# EAGLE design OutputModule (EAGLE 7.6.0)
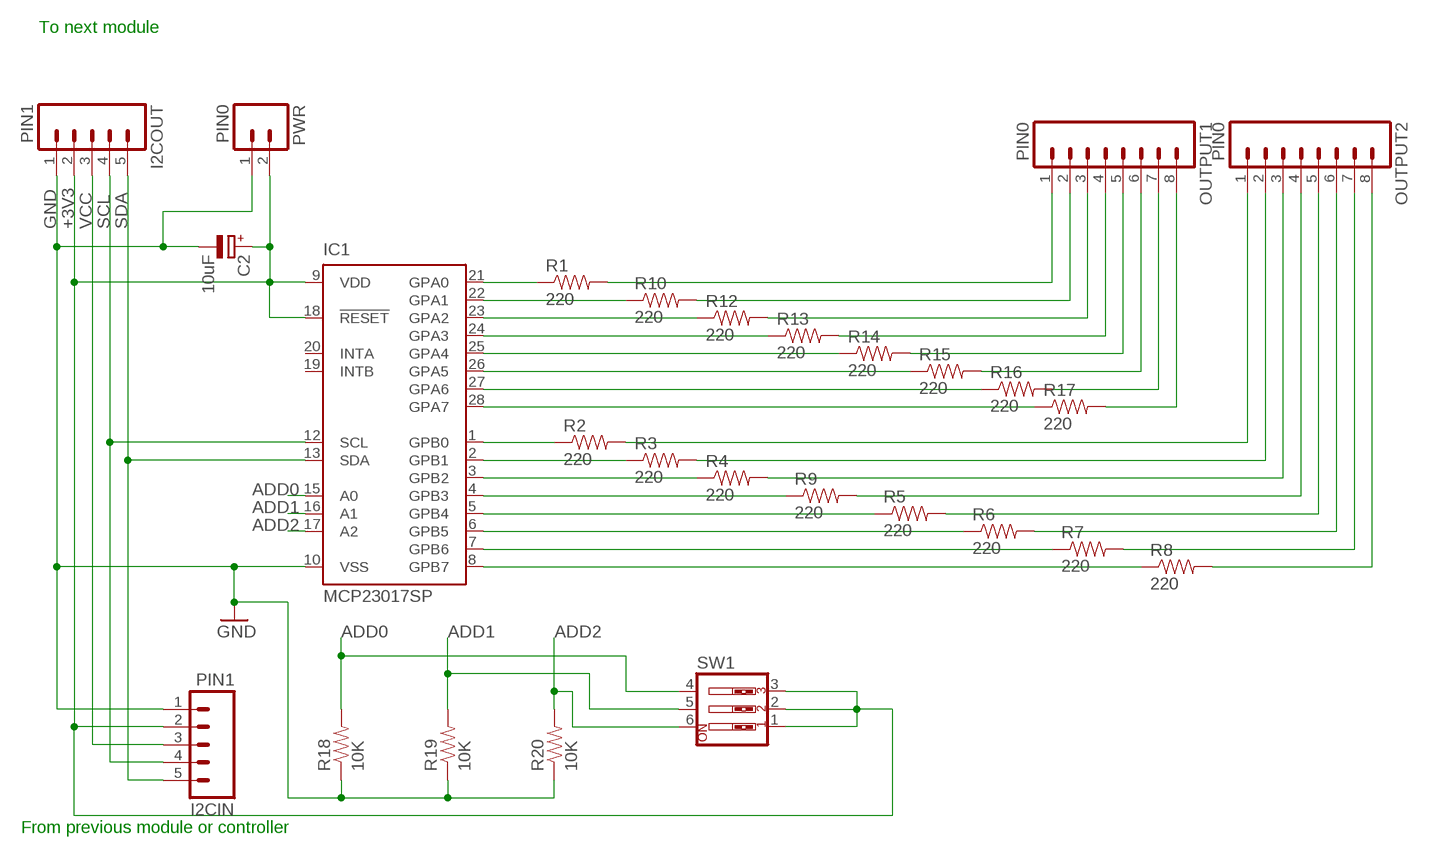
[diagram p0: schematic, sheet 1]

## Parts
C2  10uF  CPOL-EUE2.5-6  [E2,5-6]
I2CIN  PIN1  M05  [05P]
I2COUT  PIN1  M05  [05P]
IC1  MCP23017SP  [DIL28-3]
OUTPUT1  PIN0  M08  [1X08_ROUND]
OUTPUT2  PIN0  M08  [1X08_ROUND]
PWR  PIN0  M02  [02P]
R1  220  RESISTORPTH-1/4W  [AXIAL-0.4]
R2  220  RESISTORPTH-1/4W  [AXIAL-0.4]
R3  220  RESISTORPTH-1/4W  [AXIAL-0.4]
R4  220  RESISTORPTH-1/4W  [AXIAL-0.4]
R5  220  RESISTORPTH-1/4W  [AXIAL-0.4]
R6  220  RESISTORPTH-1/4W  [AXIAL-0.4]
R7  220  RESISTORPTH-1/4W  [AXIAL-0.4]
R8  220  RESISTORPTH-1/4W  [AXIAL-0.4]
R9  220  RESISTORPTH-1/4W  [AXIAL-0.4]
R10  220  RESISTORPTH-1/4W  [AXIAL-0.4]
R12  220  RESISTORPTH-1/4W  [AXIAL-0.4]
R13  220  RESISTORPTH-1/4W  [AXIAL-0.4]
R14  220  RESISTORPTH-1/4W  [AXIAL-0.4]
R15  220  RESISTORPTH-1/4W  [AXIAL-0.4]
R16  220  RESISTORPTH-1/4W  [AXIAL-0.4]
R17  220  RESISTORPTH-1/4W  [AXIAL-0.4]
R18  10K  RESISTORPTH-1/4W  [AXIAL-0.4]
R19  10K  RESISTORPTH-1/4W  [AXIAL-0.4]
R20  10K  RESISTORPTH-1/4W  [AXIAL-0.4]
SW1  SW_DIP-3  [EDG-03]

## Nets
+3V3: C2.+ I2CIN.2 I2COUT.2 IC1.9(VDD) IC1.18(!RESET) PWR.2 SW1.1 SW1.2 SW1.3
ADD0: IC1.15(A0) R18.P$2 SW1.4
ADD1: IC1.16(A1) R19.P$2 SW1.5
ADD2: IC1.17(A2) R20.P$2 SW1.6
GND: C2.- I2CIN.1 I2COUT.1 IC1.10(VSS) PWR.1 R18.P$1 R19.P$1 R20.P$1
N$1: OUTPUT2.7 R7.P$2
N$2: OUTPUT2.1 R2.P$2
N$3: OUTPUT2.2 R3.P$2
N$4: OUTPUT2.3 R4.P$2
N$5: OUTPUT2.4 R9.P$2
N$6: OUTPUT2.5 R5.P$2
N$7: OUTPUT1.8 R17.P$2
N$8: OUTPUT1.7 R16.P$2
N$9: IC1.1(GPB0) R2.P$1
N$10: IC1.2(GPB1) R3.P$1
N$11: IC1.3(GPB2) R4.P$1
N$12: IC1.5(GPB4) R5.P$1
N$13: IC1.6(GPB5) R6.P$1
N$14: IC1.7(GPB6) R7.P$1
N$15: IC1.8(GPB7) R8.P$1
N$16: OUTPUT2.6 R6.P$2
N$17: IC1.4(GPB3) R9.P$1
N$18: OUTPUT2.8 R8.P$2
N$19: IC1.21(GPA0) R1.P$1
N$20: IC1.22(GPA1) R10.P$1
N$21: IC1.23(GPA2) R12.P$1
N$22: IC1.24(GPA3) R13.P$1
N$23: IC1.25(GPA4) R14.P$1
N$24: IC1.26(GPA5) R15.P$1
N$25: IC1.27(GPA6) R16.P$1
N$26: IC1.28(GPA7) R17.P$1
N$27: OUTPUT1.6 R15.P$2
N$28: OUTPUT1.5 R14.P$2
N$29: OUTPUT1.4 R13.P$2
N$30: OUTPUT1.3 R12.P$2
N$31: OUTPUT1.2 R10.P$2
N$32: OUTPUT1.1 R1.P$2
SCL: I2CIN.4 I2COUT.4 IC1.12(SCL)
SDA: I2CIN.5 I2COUT.5 IC1.13(SDA)
VCC: I2CIN.3 I2COUT.3
Unconnected: IC1.19(INTB) IC1.20(INTA)

## Notes on the sheet
- To next module
- From previous module or controller

## Library data of the parts
C2 = rcl:CPOL-EU: POLARIZED CAPACITOR, European symbol
I2CIN I2COUT = con-amp-quick:M05: AMP QUICK CONNECTOR; OC_FARNELL: unknown; OC_NEWARK: unknown
IC1 = microchip:MCP23017: http://ww1.microchip.com/downloads/en/DeviceDoc/21952a.pdf Source: http://ww1.microchip.com/downloads/en/DeviceDoc/21952a.pdf; MF: MICROCHIP; MPN: MCP23017-E/SP; OC_FARNELL: 1332088; OC_NEWARK: 31K2959
OUTPUT1 OUTPUT2 = SparkFun-Connectors:M08: Header 8 Standard 8-pin 0.1" header. Use with straight break away headers (SKU : PRT-00116), right angle break away headers (PRT-00553), swiss pins (PRT-00743), machine pins (PRT-00117), and female headers (PRT-00115).; PROD_ID: CONN-08437
PWR = con-amp-quick:M02: AMP QUICK CONNECTOR; OC_FARNELL: unknown; OC_NEWARK: unknown
R1-R10 R12-R20 = SparkFun-Passives:RESISTOR: Resistor Basic schematic elements and footprints for 0603, 1206, and PTH resistors.
SW1 = special:SW_DIP-3: DIP SWITCH

## Board
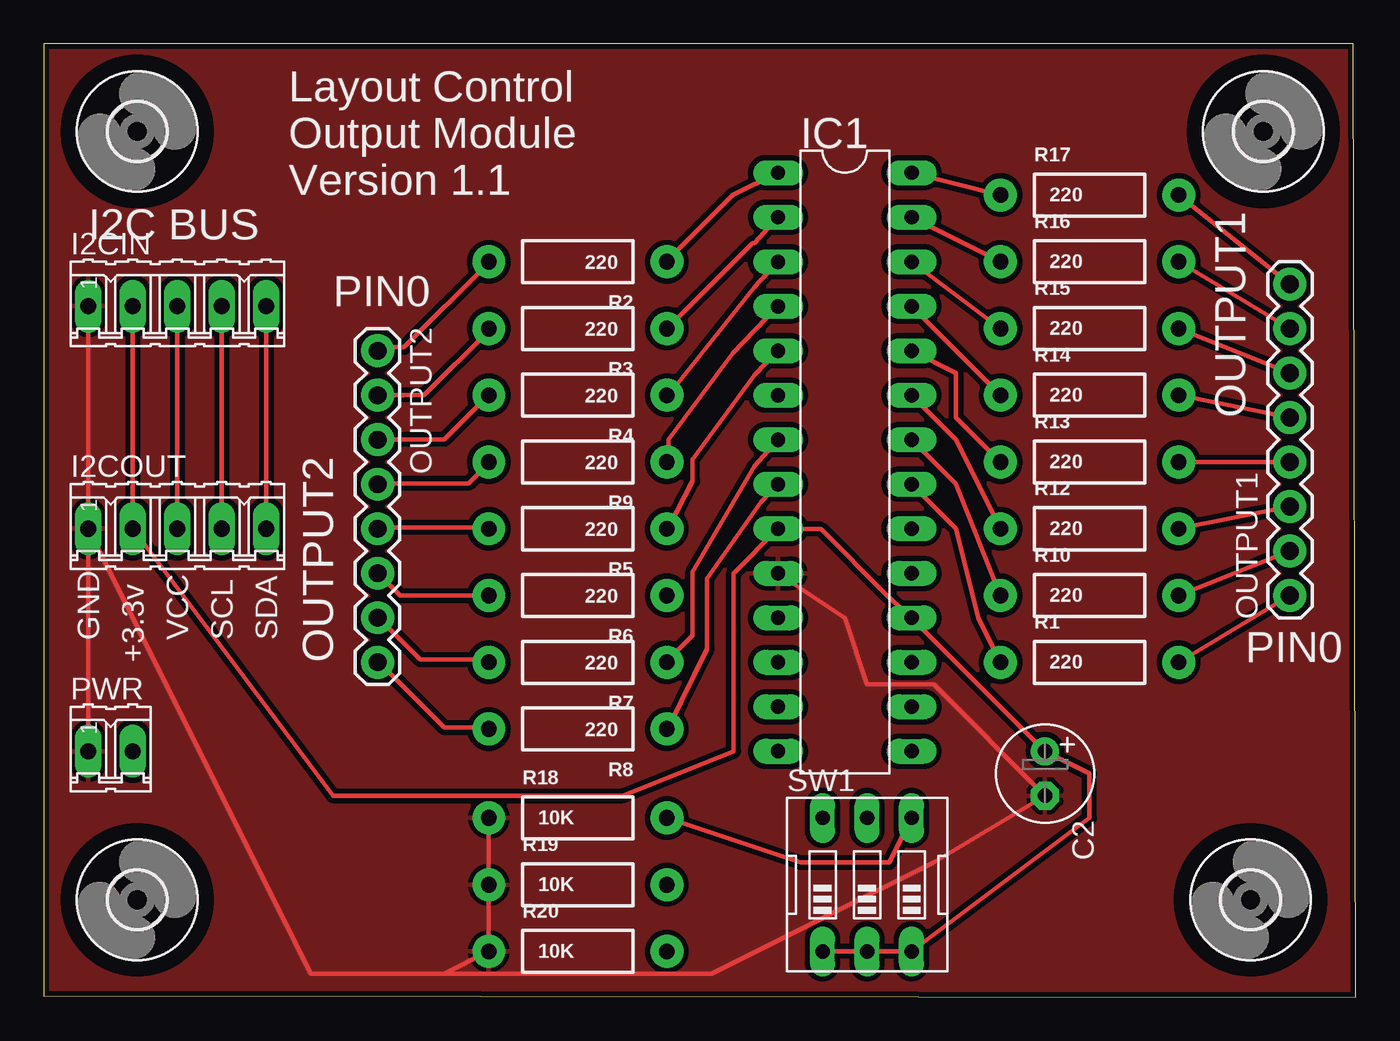
[diagram p1: board, top side]
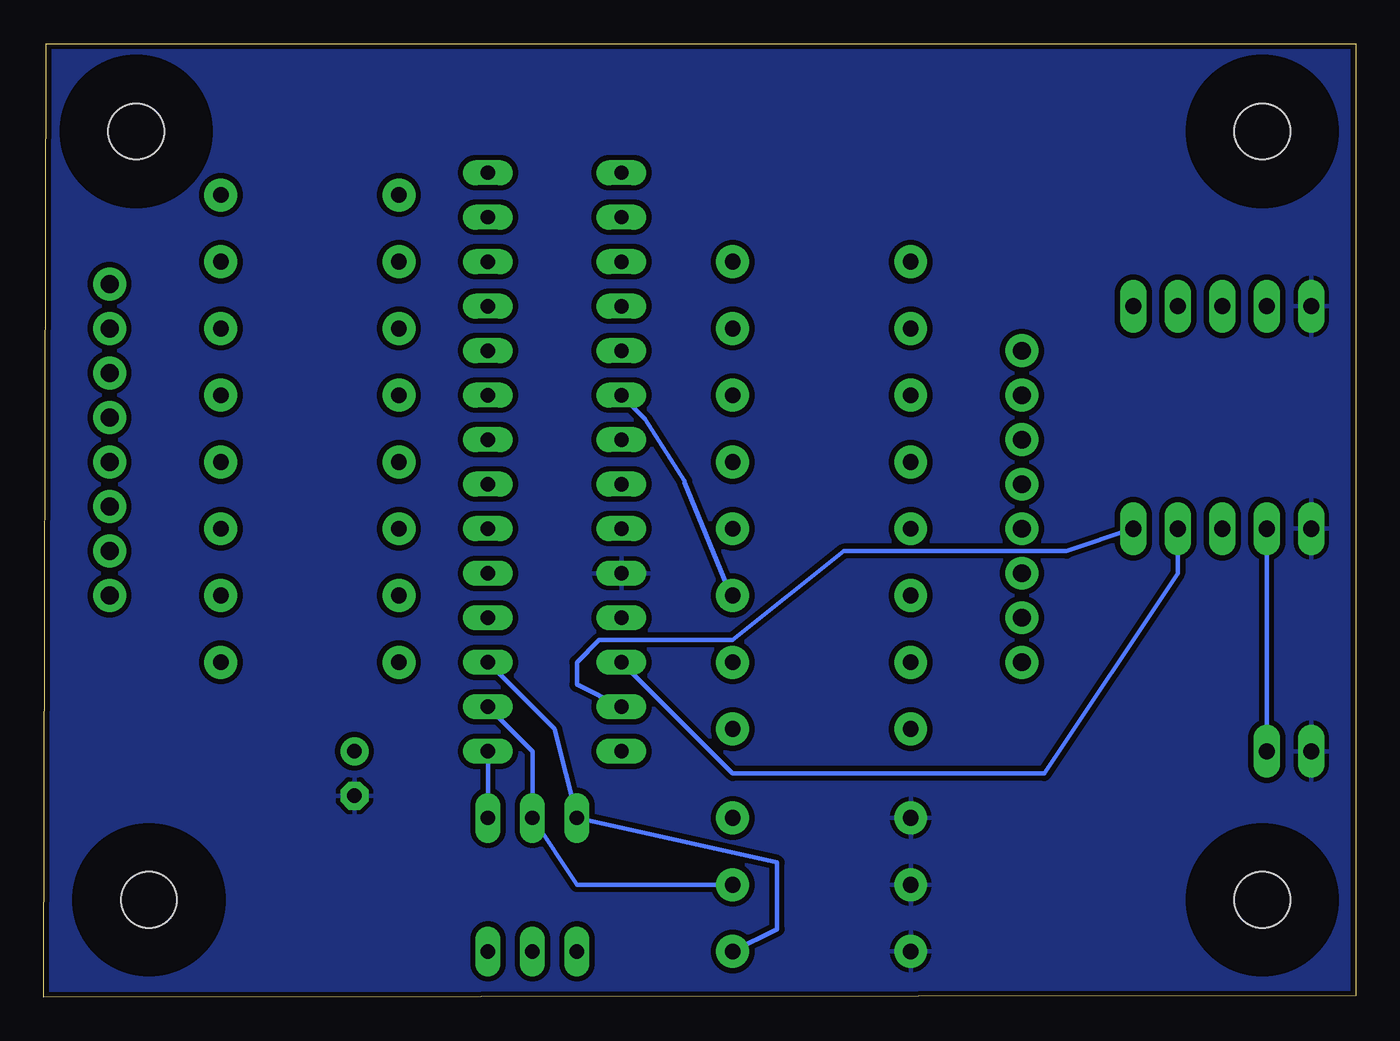
[diagram p2: board, bottom side, seen from below]

Size 74.88 x 54.41 mm. Coordinates in mm from the lower left corner, seen from the top.
Outline: 0,0.06 74.88,0 74.75,54.41 0,54.41 0,0.06
Copper layers (1*16): Top 0.035mm / dielectric 1.5mm / Bottom 0.035mm
Design rules "SparkFun": minimum track width 8mil, minimum drill 20mil, track to track 8mil, track to pad 8mil, pad to pad 8mil, via to via 8mil, smd to smd 8mil, copper to edge 8mil, drill to drill 8mil, minimum pad ring 12mil, minimum via ring 10mil, stop-mask expansion 4mil, vias tented up to drill 20mil, thermal gap 10mil

### Footprints (pad centres in the part's own frame; a part is rotated, then mirrored left to right if it is on the bottom)
E2,5-6 = drill 0.813 pad 1.6: + -1.27,0 | drill 0.813 pad 1.6 octagon: - 1.27,0
05P = drill 0.914 long: 1 -5.08,0; 2 -2.54,0; 3 0,0; 4 2.54,0; 5 5.08,0
DIL28-3 = drill 0.813 long: 1 -16.51,-3.81; 2 -13.97,-3.81; 3 -11.43,-3.81; 4 -8.89,-3.81; 5 -6.35,-3.81; 6 -3.81,-3.81; 7 -1.27,-3.81; 8 1.27,-3.81; 9 3.81,-3.81; 10 6.35,-3.81; 11 8.89,-3.81; 12 11.43,-3.81; 13 13.97,-3.81; 14 16.51,-3.81; 15 16.51,3.81; 16 13.97,3.81; 17 11.43,3.81; 18 8.89,3.81; 19 6.35,3.81; 20 3.81,3.81; 21 1.27,3.81; 22 -1.27,3.81; 23 -3.81,3.81; 24 -6.35,3.81; 25 -8.89,3.81; 26 -11.43,3.81; 27 -13.97,3.81; 28 -16.51,3.81
1X08_ROUND = drill 1.016 pad 1.88: 1 0,0; 2 2.54,0; 3 5.08,0; 4 7.62,0; 5 10.16,0; 6 12.7,0; 7 15.24,0; 8 17.78,0
02P = drill 0.914 long: 1 -1.27,0; 2 1.27,0
AXIAL-0.4 = drill 0.9 pad 1.88: P$1 -5.08,0; P$2 5.08,0
EDG-03 = drill 0.813 long: 1 -2.54,-3.81; 2 0,-3.81; 3 2.54,-3.81; 4 2.54,3.81; 5 0,3.81; 6 -2.54,3.81
3,2 = hole 3.2: 0,0

### Placement (x,y rotation side)
C2  57.15,12.76 270 top
I2CIN  7.62,39.43 0 top
I2COUT  7.62,26.73 0 top
IC1  45.72,30.54 270 top
OUTPUT1  71.12,22.92 90 top
OUTPUT2  19.05,36.89 270 top
PWR  3.81,14.03 0 top
R1  59.69,19.11 0 top
R2  30.48,41.97 180 top
R3  30.48,38.16 180 top
R4  30.48,34.35 180 top
R5  30.48,26.73 180 top
R6  30.48,22.92 180 top
R7  30.48,19.11 180 top
R8  30.48,15.3 180 top
R9  30.48,30.54 180 top
R10  59.69,22.92 0 top
R12  59.69,26.73 0 top
R13  59.69,30.54 0 top
R14  59.69,34.35 0 top
R15  59.69,38.16 0 top
R16  59.69,41.97 0 top
R17  59.69,45.78 0 top
R18  30.48,10.22 0 top
R19  30.48,6.41 0 top
R20  30.48,2.6 0 top
SW1  46.99,6.41 0 top
U$1  [3,2]  5.33,49.41 0 top
U$2  [3,2]  69.61,49.41 0 top
U$3  [3,2]  68.88,5.56 0 top
U$4  [3,2]  5.33,5.56 0 top

### Tracks (layer width: path | path; a pad name or v marks a point on that pad's centre or on a via)
+3V3
  Top 0.254: I2CIN.2 I2COUT.2 16.51,11.49 33.02,11.49 39.37,14.03 39.37,24.19 IC1.9 43.33,26.71 44.35,26.71 48.11,22.95 IC1.18 C2.+ 59.69,12.76 59.69,10.22 SW1.3 SW1.2 SW1.1
  Bottom 0.254: PWR.2 I2COUT.2
ADD0
  Top 0.254: R18.P$2 43.18,7.68 48.26,7.68 SW1.4
  Bottom 0.254: SW1.4 IC1.15
ADD1
  Bottom 0.254: IC1.16 46.99,14.03 SW1.5 44.45,6.41 R19.P$2
ADD2
  Bottom 0.254: IC1.17 45.72,15.3 SW1.6 33.02,7.68 33.02,3.87 R20.P$2
GND
  Top 0.254: I2CIN.1 I2COUT.1 | IC1.10 45.72,21.65 46.99,17.84 50.8,17.84 C2.- 50.8,7.68 38.1,1.33 22.86,1.33 | I2COUT.1 15.24,1.33 22.86,1.33 | R18.P$1 R19.P$1 R20.P$1 22.86,1.33 | PWR.1 I2COUT.1
  pour Bottom (isolate 0.305): 0,0.06 0,54.67 74.93,54.67 74.93,0.06
  pour Top (isolate 0.305): 0,0.06 0,54.67 74.93,54.67 74.93,0.06
N$1
  Top 0.254: R7.P$2 25.38,19.26 21.49,19.26 19.2,21.55 OUTPUT2.7
N$2
  Top 0.254: OUTPUT2.1 19.2,37.1 20.57,37.1 25.38,41.9 R2.P$2
N$3
  Top 0.254: OUTPUT2.2 21.72,34.35 25.38,38.01 R3.P$2
N$4
  Top 0.254: OUTPUT2.3 19.2,31.84 22.86,31.84 25.38,34.35 R4.P$2
N$5
  Top 0.254: OUTPUT2.4 19.2,29.32 24.23,29.32 25.38,30.47 R9.P$2
N$6
  Top 0.254: OUTPUT2.5 19.2,26.81 25.38,26.81 R5.P$2
N$7
  Top 0.254: R17.P$2 OUTPUT1.8
N$8
  Top 0.254: R16.P$2 OUTPUT1.7
N$9
  Top 0.254: IC1.1 39.32,45.78 35.66,42.12 R2.P$1
N$10
  Top 0.254: IC1.2 40.56,43.04 40.46,43.04 35.66,38.24 R3.P$1
N$11
  Top 0.254: IC1.3 40.56,40.52 35.66,34.35 R4.P$1
N$12
  Top 0.254: IC1.5 40.56,35.5 37.03,30.69 37.03,29.45 35.66,26.81 R5.P$1
N$13
  Bottom 0.254: IC1.6 40.56,32.98 38.3,29.45 38.3,29.37 35.66,22.92 R6.P$1
N$14
  Top 0.254: IC1.7 41.83,31.74 40.56,30.32 37.03,24.25 37.03,20.64 35.66,19.26 R7.P$1
N$15
  Top 0.254: IC1.8 41.83,29.22 40.94,28.25 37.87,23.9 37.87,19.87 35.66,15.38 R8.P$1
N$16
  Top 0.254: R6.P$2 20.34,22.92 19.2,24.07 OUTPUT2.6
N$17
  Top 0.254: IC1.4 39.29,36.74 35.66,31.84 35.66,30.69 R9.P$1
N$18
  Top 0.254: R8.P$2 25.38,15.38 22.86,15.38 19.2,19.04 OUTPUT2.8
N$19
  Top 0.254: IC1.21 52.07,26.73 53.34,21.65 R1.P$1
N$20
  Top 0.254: IC1.22 52.07,29.27 R10.P$1
N$21
  Top 0.254: IC1.23 52.07,31.81 R12.P$1
N$22
  Top 0.254: IC1.24 52.07,35.62 52.07,33.08 R13.P$1
N$23
  Top 0.254: IC1.25 R14.P$1
N$24
  Top 0.254: IC1.26 R15.P$1
N$25
  Top 0.254: IC1.27 R16.P$1
N$26
  Top 0.254: IC1.28 R17.P$1
N$27
  Top 0.254: R15.P$2 OUTPUT1.6
N$28
  Top 0.254: R14.P$2 OUTPUT1.5
N$29
  Top 0.254: R13.P$2 OUTPUT1.4
N$30
  Top 0.254: R12.P$2 OUTPUT1.3
N$31
  Top 0.254: R10.P$2 OUTPUT1.2
N$32
  Top 0.254: R1.P$2 OUTPUT1.1
SCL
  Top 0.254: I2CIN.4 I2COUT.4
  Bottom 0.254: I2COUT.4 10.16,24.19 17.78,12.76 35.56,12.76 IC1.12
SDA
  Top 0.254: I2CIN.5 I2COUT.5
  Bottom 0.254: I2COUT.5 16.51,25.46 29.21,25.46 35.56,20.38 43.18,20.38 44.45,19.11 44.45,17.84 IC1.13
VCC
  Top 0.254: I2CIN.3 I2COUT.3
  Bottom 0.254: I2COUT.3 7.62,25.46

### Text on the board
tPlace: Layout Control / Output Module / Version 1.1 | I2C BUS | PIN0 | OUTPUT1 | GND | VCC | SCL | SDA | +3.3v | OUTPUT2 | PIN0